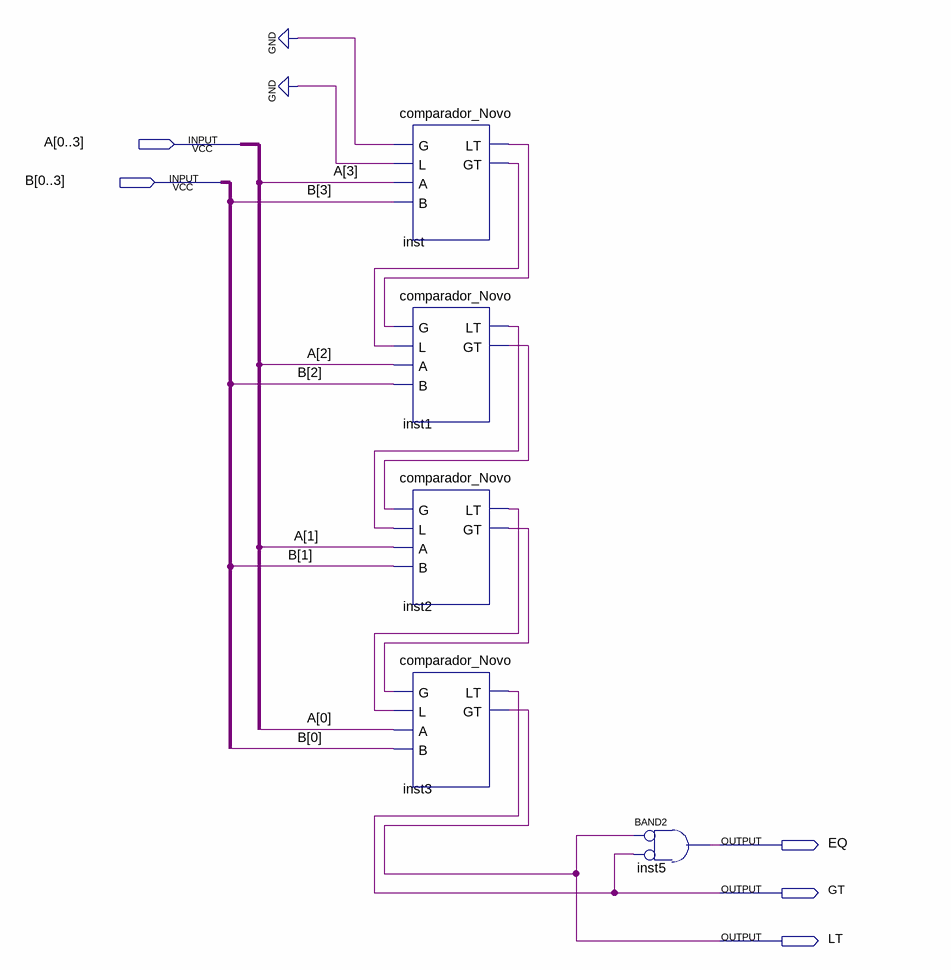
[diagram p0: schematic sheet]
// Quartus schematic Comparador_NOVOCOMPLETO.bdf as structural Verilog: 5 symbols, 5 pins
module Comparador_NOVOCOMPLETO (
  input  [0:3] A,
  input  [0:3] B,
  output EQ,
  output GT,
  output LT
);

  wire inst1_gt, inst1_lt, inst2_gt, inst2_lt, inst_gt, inst_lt;

  comparador_Novo inst (.G(1'b0), .L(1'b0), .A(A[3]), .B(B[3]), .LT(inst_lt), .GT(inst_gt));
  comparador_Novo inst1 (.G(inst_lt), .L(inst_gt), .A(A[2]), .B(B[2]), .LT(inst1_lt), .GT(inst1_gt));
  comparador_Novo inst2 (.G(inst1_gt), .L(inst1_lt), .A(A[1]), .B(B[1]), .LT(inst2_lt), .GT(inst2_gt));
  comparador_Novo inst3 (.G(inst2_gt), .L(inst2_lt), .A(A[0]), .B(B[0]), .LT(GT), .GT(LT));
  and inst5 (EQ, ~LT, ~GT);  // BAND2
endmodule
